# Altium project XsensCustomDevKit.PrjPcb
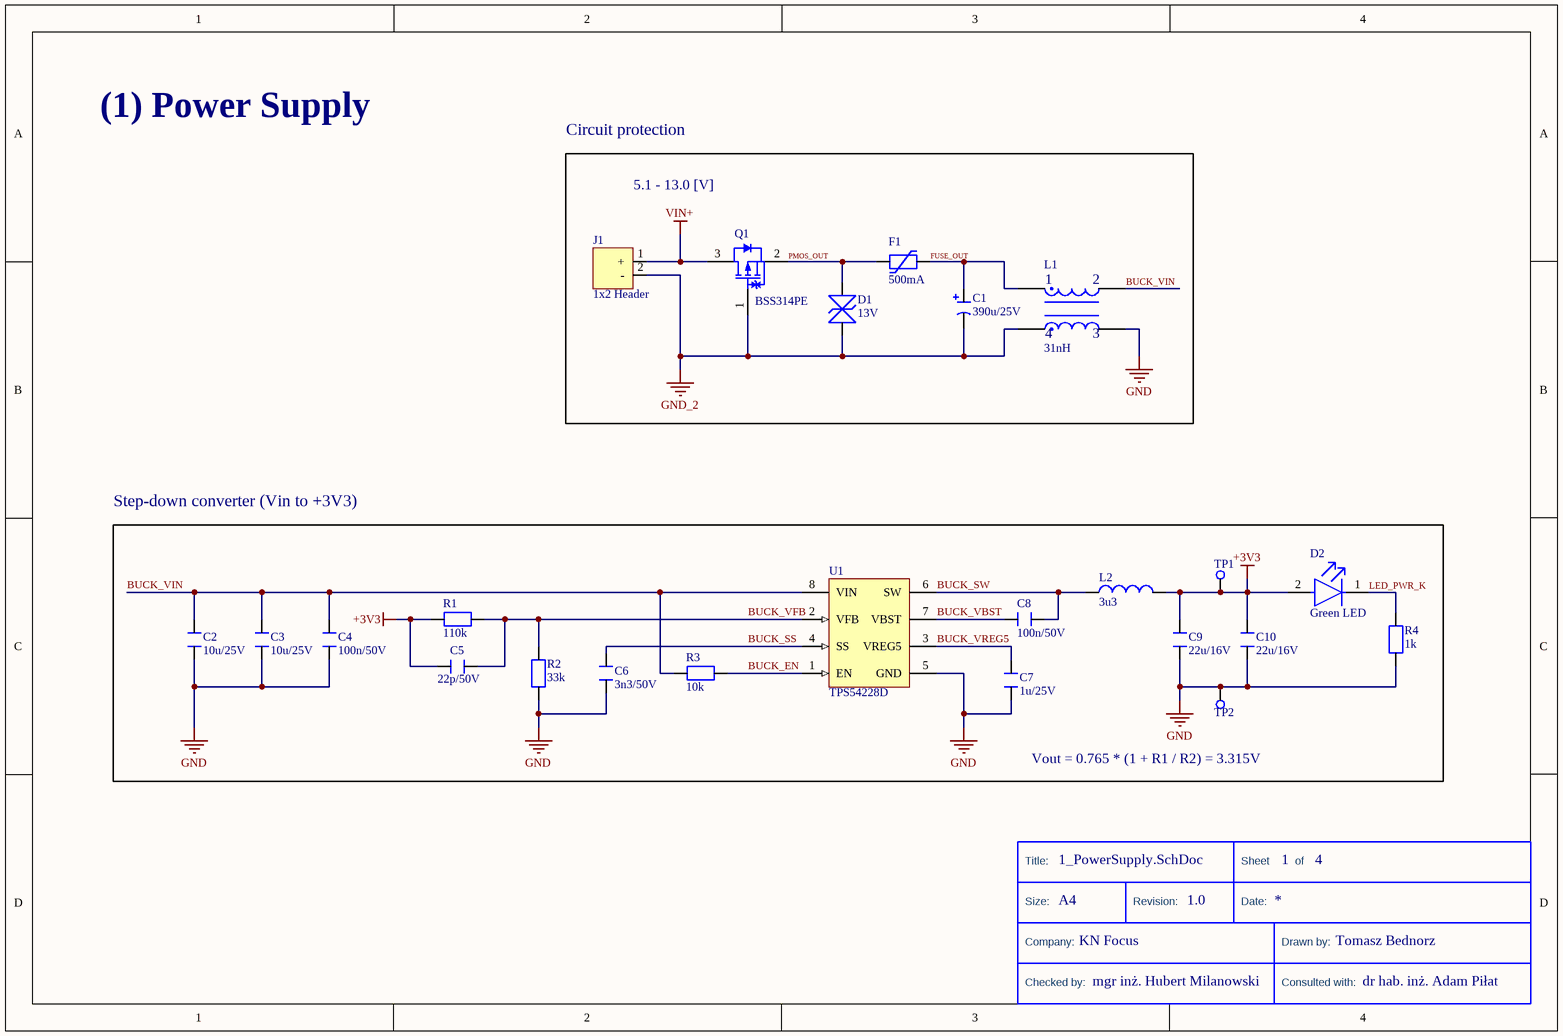
[diagram p0: 1_PowerSupply.SchDoc]
CheckedBy: mgr inż. Hubert Milanowski; CompanyName: KN Focus; ConsultedBy: dr hab. inż. Adam Piłat; DrawnBy: Tomasz Bednorz; Revision: 2.0
4 sheets, 78 parts. Net scope: flat (ports and power ports of the same name join across sheets).
Board file: XSensCustomDevKitPCB.PcbDoc
Sheets:
  1_PowerSupply.SchDoc
  2_MCU.SchDoc
  3_IMU_ETH.SchDoc
  4_SD_Card.SchDoc

## Sheet 1_PowerSupply.SchDoc
size A4; Revision: 1.0; SheetNumber: 1; SheetTotal: 4

### Parts
(Parts that share a designator on the sheet are numbered #1, #2 ... from top to bottom, then left to right.)
*#1  Size: A4  (hidden comment: TitleBlock)  (graphical)
C1  390u/25V  [CAP_ELECTROLYTIC D8]
C2  10u/25V  [CAP_1206]
C3  10u/25V  [CAP_1206]
C4  100n/50V  [CAP_1206]
C5  22p/50V  [CAP_1206]
C6  3n3/50V  [CAP_1206]
C7  1u/25V  [CAP_1206]
C8  100n/50V  [CAP_1206]
C9  22u/16V  [CAP_1206]
C10  22u/16V  [CAP_1206]
D1  13V  [TVS_Littlefuse]
D2  Green LED  [FP-LTST-C150KGKT-MFG]
F1  500mA  [Fuse_1210]
J1  1x2 Header  [1x2 Header (Terminal Block 5.08mm)]
L1  31nH  [CMC-1206USB]
L2  3u3  [IND_DJNR5020-3R3-S]
Q1  BSS314PE  [INF-PG-SOT23_N]
R1  110k  [RES_1206]
R2  33k  [RES_1206]
R3  10k  [RES_1206]
R4  1k  [RES_1206]
TP1  TestPoint Pad 1.0mmx1.0mm  [TestPoint Pad 1.0mmx1.0mm]  (value not drawn)
TP2  TestPoint Pad 1.0mmx1.0mm  [TestPoint Pad 1.0mmx1.0mm]  (value not drawn)
U1  TPS54228D  [D0008A_L]

### Blocks framed on the sheet
Circuit protection: C1 D1 F1 J1 L1 Q1
Step-down converter (Vin to +3V3): C2-C10 D2 L2 R1-R4 TP1 TP2 U1

### Nets
+3V3: C5.2 C9.1 C10.1 D2.2(A) L2.2 R1.2 TP1.1
GND: C2.1 C3.1 C4.1 C6.1 C7.2 C9.2 C10.2 L1.3 R2.2 R4.2 TP2.1 U1.5(GND)
GND_2: C1.1 D1.2 J1.2(-) L1.4 Q1.1(GATE)
VIN+: J1.1(+) Q1.3(DRAIN)
BUCK_EN: R3.1 U1.1(EN)
BUCK_SS: C6.2 U1.4(SS)
BUCK_SW: C8.2 L2.1 U1.6(SW)
BUCK_VBST: C8.1 U1.7(VBST)
BUCK_VFB: C5.1 R1.1 R2.1 U1.2(VFB)
BUCK_VIN: C2.2 C3.2 C4.2 L1.2 R3.2 U1.8(VIN)
BUCK_VREG5: C7.1 U1.3(VREG5)
FUSE_OUT: C1.2 F1.2 L1.1
LED_PWR_K: D2.1(C) R4.1
PMOS_OUT: D1.1 F1.1 Q1.2(SOURCE)

### Notes on the sheet
- (1) Power Supply
- 5.1 - 13.0 [V]
- Vout = 0.765 * (1 + R1 / R2) = 3.315V
- (in symbol TitleBlock) Title:; Sheet; of; Size:; Revision:; Date:; Company:; Drawn by:; Checked by:; Consulted with:

### Library data of the parts
*#1 = TitleBlock: Standard Title Block
C1 = CAP_ELECTROLYTIC D8
C2-C10 = CAP_1206: Generic 1206/3216 capacitor
D1 = TVS_13V: TVS Diode TVS_SMAJ13CA  13V Bidirectional
D2 = CMP-22017-000010-1: LED GREEN CLEAR 1206 SMD; Power Dissipation: 75mW; Number of LEDs: 1; Reverse Voltage: 5V; Lens Style: Diffused; Test Current: 20mA; Forward Current: 30mA; Luminous Intensity: 71mcd; Dominant Wavelength: 571nm; Lens Color: Colorless; Viewing Angle: 130°; Forward Voltage: 2V; Wavelength: 574nm; Length: 3.2mm; Case Code (Imperial): 1206; Illumination Color: Green; Number of Pins: 2; Case Code (Metric): 3216; Package Quantity: 1; Height: 1.1mm; Power Rating: 75mW; Color: Green; Lead Free: Lead Free; Mount: Surface Mount; Radiation Hardening: No; Max Operating Temperature: 85°C; Depth: 1.6mm; Case/Package: 1206; Number of Elements: 1; Lens Transparency: Clear; Min Operating Temperature: -55°C; Packaging: Tape and Reel; Width: 1.6mm
F1 = FUSE_0ZCH0050FF2G: FUSE 500mA/16V
J1 = 1x2 Header (Terminal Block 5.08mm): 1x2 Header, Through Hole(Terminal Block 5.08mm)
L1 = CMC-1206USB: 31nH @ 100MHz 2 Line Common Mode Choke Surface Mount 37 Ohms @ 100MHz 1A DCR 0.1 Ohms
L2 = IND_DJNR5020-3R3-S
Q1 = CMP-1099-00027-1: P-Channel OptiMOS P3 Small-Signal-Transistor, -30 V VDS, -1.5 A ID, -55 to 150 degC, PG-SOT23, Reel, Green; Manufacturer: Infineon; Rth: 250Â K/W; RDS (on) (max): 140Â mOhm; QG: -2.9Â nC; IDpuls (max): -6.1Â A; RDS (on) (max) (@4.5V): 230Â mOhm; Pto t (max): 0.5Â W; Green: TRUE; VDS (max): -30Â V; VGS(th) (max): -2Â V; VGS(th) (min): -1Â V; ID (max): -1.5Â A; ComponentLink2URL: http://www.infineon.com/dgdl/BSS314PE_rev2.3.pdf?folderId=db3a304314dca38901154a72e3951a65&fileId=db3a304330f68606013109b696aa0084; ComponentLink3Description: Package Specification; ComponentLink1URL: http://www.infineon.com/; ComponentLink1Description: Manufacturer URL; Mounting Technology: Surface Mount; PartNumber: BSS314PE; PackageReference: PG-SOT23; PackageVersion: Apr-08; Halogen-free: TRUE; ComponentLink3URL: http://www.infineon.com/dgdl/SOT23-Package_Overview.pdf?folderId=db3a30431936bc4b0119532290053c66&fileId=db3a30431936bc4b0119533468123c85; PackageDescription: 3-Pin Small Outline Transistor Package, 2.9 x 1.3 mm Body, 0.95 mm Pitch; ComponentLink2Description: Datasheet; DatasheetVersion: Rev. 2.3; Packing: Reel
R1-R4 = RES_1206: Generic 1206/3216 resistor
U1 = CMP-0323-00178-3: Buck Step Down Regulator with 4.5 to 18 V Input and 0.76 to 7 V Output, -40 to 85 degC, 8-Pin SOIC (D), Green (RoHS & no Sb/Br); Manufacturer: Texas Instruments; Iout(Max)(A): 2; Vout(Min)(V): 0.76; Switch Current Limit(Typ)(A): 3.3; Rating: Catalog; SubFamily: Step-Down Regulator; Vin(Max)(V): 18; Duty Cycle(Max)(%): 90; Iq(Typ)(mA): 0.8; Regulated Outputs(#): 1; Synchronous Rectification: TRUE; Vin(Min)(V): 4.5; Vout(Max)(V): 7; ComponentLink1Description: Datasheet; Topology: Buck; ComponentLink2Description: Package Specification; PackageVersion: revM, Jun-2011; Mounting Technology: Surface Mount; PackageDescription: 8-Pin Plastic Small Outline Integrated Circuit, 4.9 x 3.9 mm, Pitch 1.27 mm Pitch; ComponentLink3URL: Samples URL:http://www.ti.com/product/tps54228#samples; ComponentLink2URL: http://www.ti.com/litv/pdf/msoi002j; ComponentLink3Description: URL Link1; PartNumber: TPS54228D; Code_JEDEC: MS-012AA; DatasheetVersion: SLVSAU1C; Eco-Plan: Green (RoHS & no Sb/Br); ComponentLink1URL: http://www.ti.com/general/docs/lit/getliterature.tsp?genericPartNumber=TPS54228&fileType=pdf; PackageReference: D0008A

## Sheet 2_MCU.SchDoc
size A3; Revision: 1.0; SheetNumber: 2; SheetTotal: 4
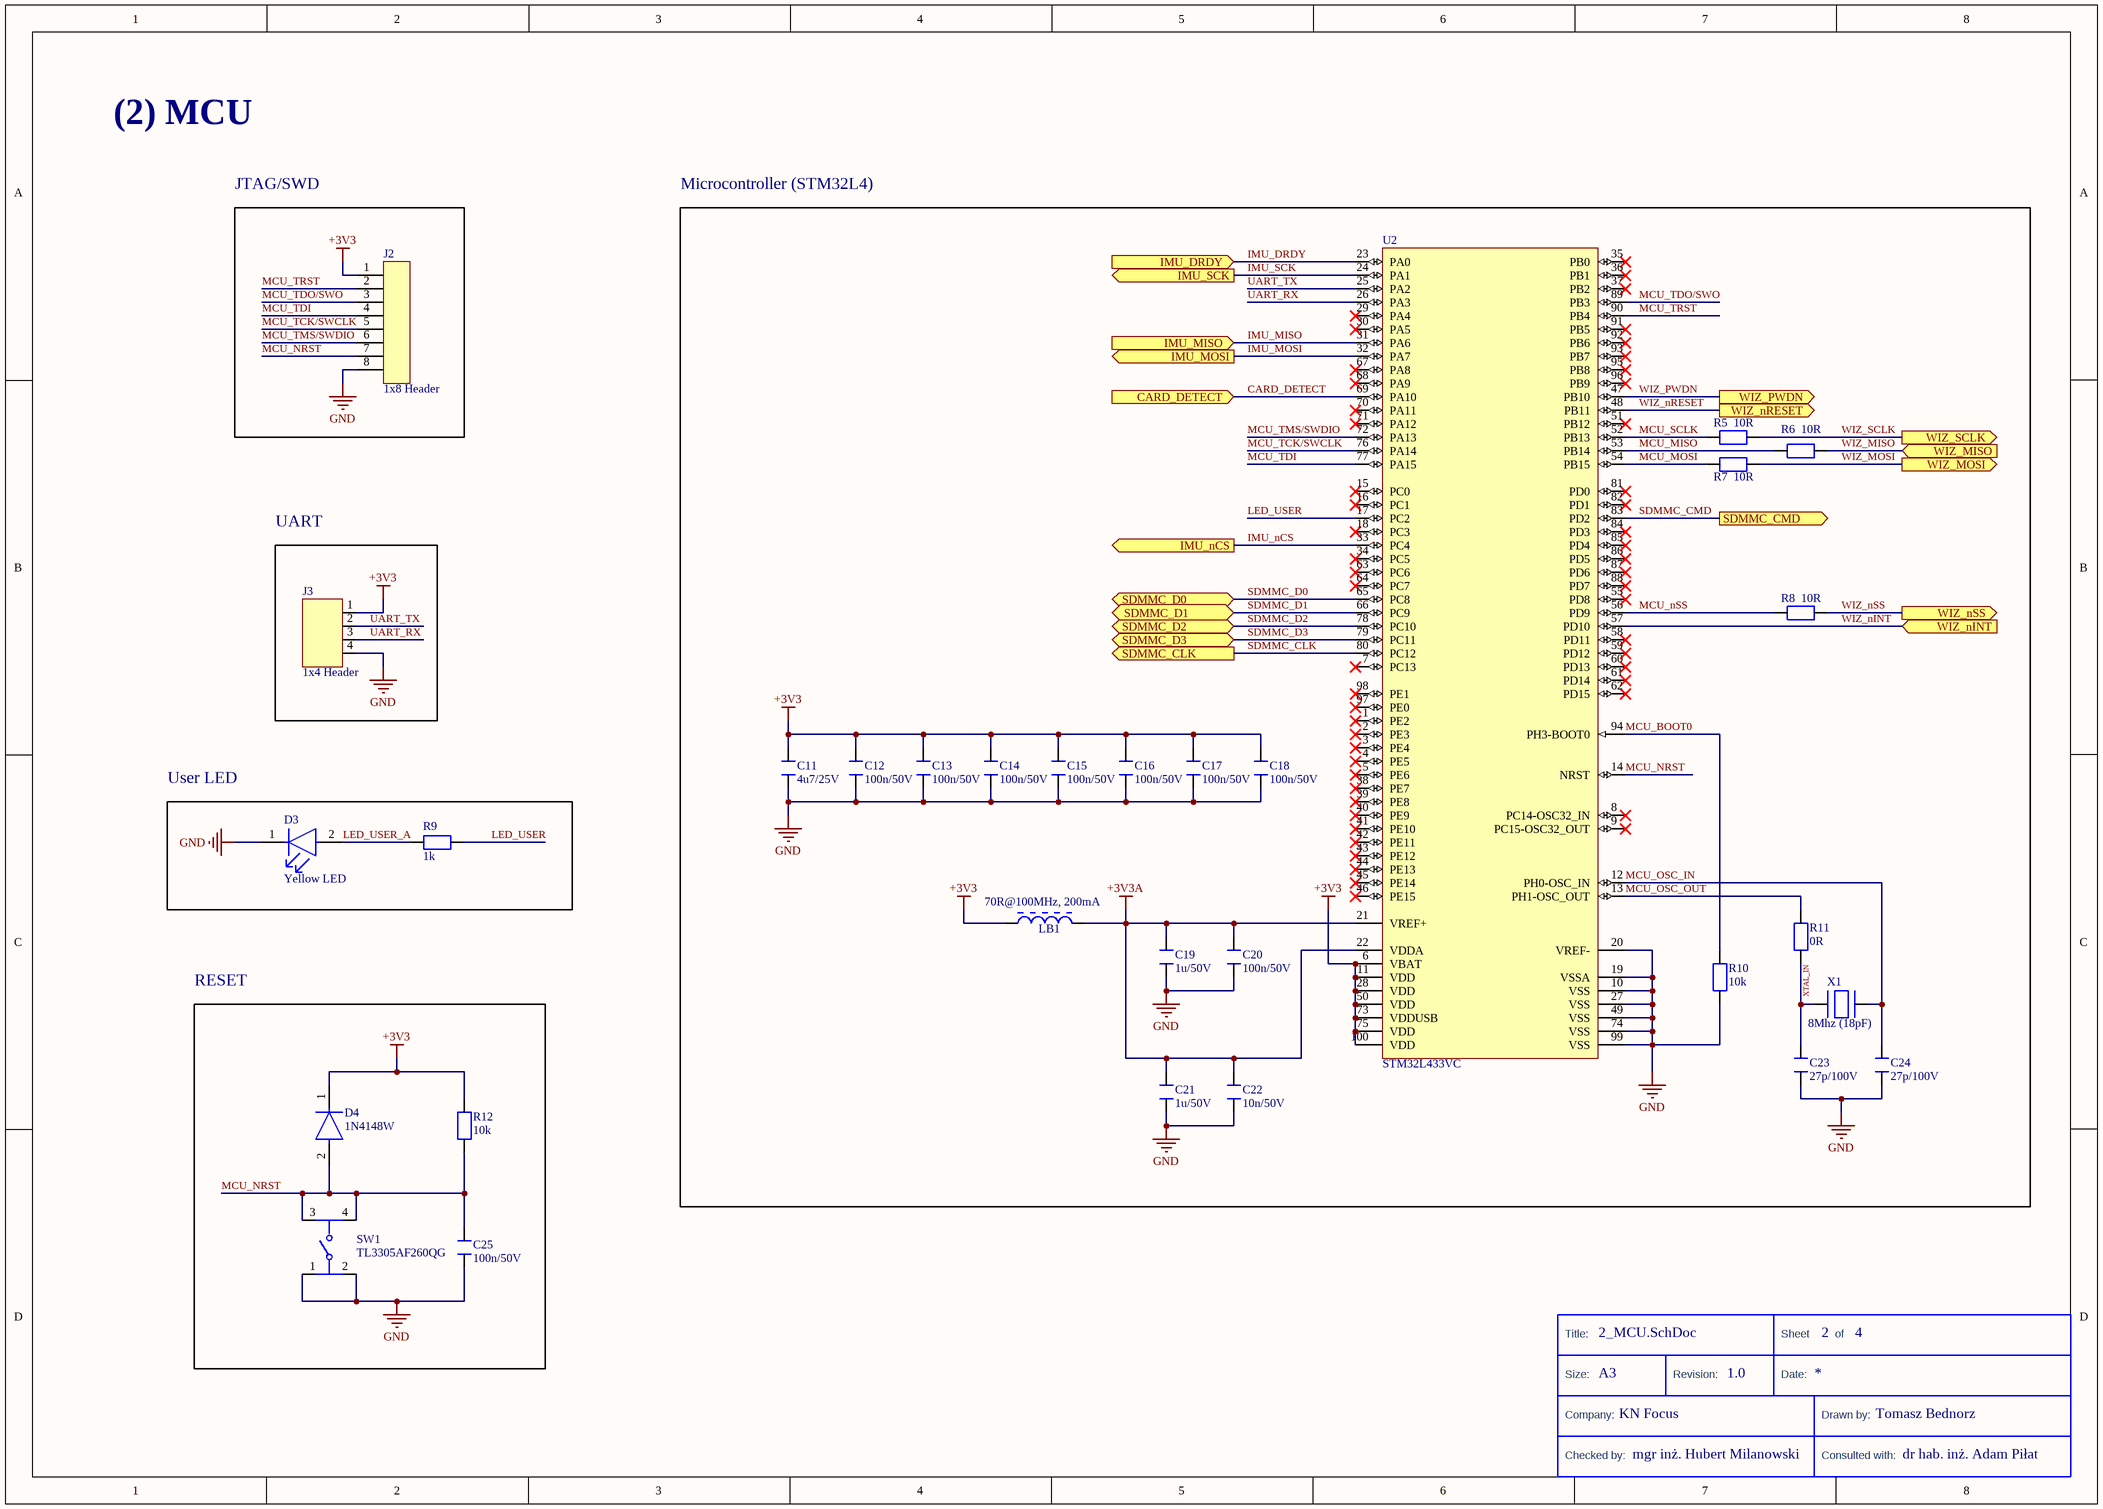
[diagram p1: 2_MCU.SchDoc]

### Parts
(Parts that share a designator on the sheet are numbered #1, #2 ... from top to bottom, then left to right.)
*#2  Size: A3  (hidden comment: TitleBlock)  (graphical)
C11  4u7/25V  [CAP_1206]
C12  100n/50V  [CAP_1206]
C13  100n/50V  [CAP_1206]
C14  100n/50V  [CAP_1206]
C15  100n/50V  [CAP_1206]
C16  100n/50V  [CAP_1206]
C17  100n/50V  [CAP_1206]
C18  100n/50V  [CAP_1206]
C19  1u/50V  [CAP_1206]
C20  100n/50V  [CAP_1206]
C21  1u/50V  [CAP_1206]
C22  10n/50V  [CAP_1206]
C23  27p/100V  [CAP_1206]
C24  27p/100V  [CAP_1206]
C25  100n/50V  [CAP_1206]
D3  Yellow LED  [FP-LTST-C150KSKT-MFG]
D4  1N4148W  [FP-SOD-123-IPC_A]
J2  1x8 Header  [1x8 Header]
J3  1x4 Header  [1x4 Header (Goldpin 2.54mm)]
LB1  70R@100MHz, 200mA  [MURA-BLM31A_L]
R5  10R  [RES_1206]
R6  10R  [RES_1206]
R7  10R  [RES_1206]
R8  10R  [RES_1206]
R9  1k  [RES_1206]
R10  10k  [RES_1206]
R11  0R  [RES_1206]
R12  10k  [RES_1206]
SW1  TL3305AF260QG  [FP-TL3305AF260QG-MFG]
U2  STM32L433VC  [LQFP100]
X1  8Mhz (18pF)  [XTAL-12.5x4.8]

### Blocks framed on the sheet
JTAG/SWD: J2
Microcontroller (STM32L4): C11-C24 LB1 R5-R8 R10 R11 U2 X1
UART: J3
User LED: D3 R9
RESET: C25 D4 R12 SW1

### Ports
CARD_DETECT (in), IMU_DRDY (in), IMU_MISO (in), IMU_MOSI (out), IMU_nCS (out), IMU_SCK (out), SDMMC_CLK (out), SDMMC_CMD (out), SDMMC_D0 (bidir), SDMMC_D1 (bidir), SDMMC_D2 (bidir), SDMMC_D3 (bidir), WIZ_MISO (in), WIZ_MOSI (out), WIZ_nINT (in), WIZ_nRESET (out), WIZ_nSS (out), WIZ_PWDN (out), WIZ_SCLK (out)

### Nets
+3V3: C11.2 C12.2 C13.2 C14.2 C15.2 C16.2 C17.2 C18.2 D4.1(C) J2.1 J3.1 LB1.1 R12.2 U2.6(VBAT) U2.11(VDD) U2.28(VDD) U2.50(VDD) U2.73(VDDUSB) U2.75(VDD) U2.100(VDD)
+3V3A: C19.2 C20.2 C21.2 C22.2 LB1.2 U2.21(VREF+) U2.22(VDDA)
GND: C11.1 C12.1 C13.1 C14.1 C15.1 C16.1 C17.1 C18.1 C19.1 C20.1 C21.1 C22.1 C23.1 C24.1 C25.1 D3.1(C) J2.8 J3.4 R10.1 SW1.1 SW1.2 U2.10(VSS) U2.19(VSSA) U2.20(VREF-) U2.27(VSS) U2.49(VSS) U2.74(VSS) U2.99(VSS)
CARD_DETECT: U2.69(PA10) ; port CARD_DETECT
IMU_DRDY: U2.23(PA0) ; port IMU_DRDY
IMU_MISO: U2.31(PA6) ; port IMU_MISO
IMU_MOSI: U2.32(PA7) ; port IMU_MOSI
IMU_nCS: U2.33(PC4) ; port IMU_nCS
IMU_SCK: U2.24(PA1) ; port IMU_SCK
LED_USER: R9.1 U2.17(PC2)
LED_USER_A: D3.2(A) R9.2
MCU_BOOT0: R10.2 U2.94(PH3-BOOT0)
MCU_MISO: R6.2 U2.53(PB14)
MCU_MOSI: R7.2 U2.54(PB15)
MCU_NRST: C25.2 D4.2(A) J2.7 R12.1 SW1.3 SW1.4 U2.14(NRST)
MCU_nSS: R8.2 U2.56(PD9)
MCU_OSC_IN: C24.2 U2.12(PH0-OSC_IN) X1.2
MCU_OSC_OUT: R11.1 U2.13(PH1-OSC_OUT)
MCU_SCLK: R5.2 U2.52(PB13)
MCU_TCK/SWCLK: J2.5 U2.76(PA14)
MCU_TDI: J2.4 U2.77(PA15)
MCU_TDO/SWO: J2.3 U2.89(PB3)
MCU_TMS/SWDIO: J2.6 U2.72(PA13)
MCU_TRST: J2.2 U2.90(PB4)
SDMMC_CLK: U2.80(PC12) ; port SDMMC_CLK
SDMMC_CMD: U2.83(PD2) ; port SDMMC_CMD
SDMMC_D0: U2.65(PC8) ; port SDMMC_D0
SDMMC_D1: U2.66(PC9) ; port SDMMC_D1
SDMMC_D2: U2.78(PC10) ; port SDMMC_D2
SDMMC_D3: U2.79(PC11) ; port SDMMC_D3
UART_RX: J3.3 U2.26(PA3)
UART_TX: J3.2 U2.25(PA2)
WIZ_MISO: R6.1 ; port WIZ_MISO
WIZ_MOSI: R7.1 ; port WIZ_MOSI
WIZ_nINT: U2.57(PD10) ; port WIZ_nINT
WIZ_nRESET: U2.48(PB11) ; port WIZ_nRESET
WIZ_nSS: R8.1 ; port WIZ_nSS
WIZ_PWDN: U2.47(PB10) ; port WIZ_PWDN
WIZ_SCLK: R5.1 ; port WIZ_SCLK
XTAL_IN: C23.2 R11.2 X1.1

Not connected (* = marked no-connect by the designer): U2 1(PE2)* 2(PE3)* 3(PE4)* 4(PE5)* 5(PE6)* 7(PC13)* 8(PC14-OSC32_IN)* 9(PC15-OSC32_OUT)* 15(PC0)* 16(PC1)* 18(PC3)* 29(PA4)* 30(PA5)* 34(PC5)* 35(PB0)* 36(PB1)* 37(PB2)* 38(PE7)* 39(PE8)* 40(PE9)* 41(PE10)* 42(PE11)* 43(PE12)* 44(PE13)* 45(PE14)* 46(PE15)* 51(PB12)* 55(PD8)* 58(PD11)* 59(PD12)* 60(PD13)* 61(PD14)* 62(PD15)* 63(PC6)* 64(PC7)* 67(PA8)* 68(PA9)* 70(PA11)* 71(PA12)* 81(PD0)* 82(PD1)* 84(PD3)* 85(PD4)* 86(PD5)* 87(PD6)* 88(PD7)* 91(PB5)* 92(PB6)* 93(PB7)* 95(PB8)* 96(PB9)* 97(PE0)* 98(PE1)*

### Notes on the sheet
- (2) MCU
- (in symbol TitleBlock) Title:; Sheet; of; Size:; Revision:; Date:; Company:; Drawn by:; Checked by:; Consulted with:

### Library data of the parts
*#2 = TitleBlock: Standard Title Block
C11-C25 = CAP_1206: Generic 1206/3216 capacitor
D3 = CMP-2000-06618-2: LED YELLOW CLEAR 1206 SMD; Power Rating: 75mW; Wavelength: 588nm; Forward Current: 30mA; Test Current: 20mA; Viewing Angle: 130°; Forward Voltage: 2.4V; Luminous Intensity: 60mcd; Lens Style: Diffused; Number of Elements: 1; Reverse Voltage: 5V; Lens Color: Colorless; Dominant Wavelength: 587nm; Mount: Surface Mount; Min Operating Temperature: -55°C; Depth: 1.6mm; Max Operating Temperature: 85°C; Color: Yellow; Power Dissipation: 75mW; Width: 1.6mm; Packaging: Tape and Reel; Length: 3.2mm; Illumination Color: Yellow; Number of Pins: 2; Case Code (Metric): 3216; Lead Free: Lead Free; Package Quantity: 1; Radiation Hardening: No; Height: 1.1mm; Case Code (Imperial): 1206; Number of LEDs: 1; Case/Package: 1206; Lens Transparency: Clear
D4 = CMP-2000-04993-2: DIODE GEN PURP 100V 150MA SOD123; Max Reverse Leakage Current: 5uA; Max Surge Current: 2A; Reverse Recovery Time: 4ns; Polarity: Standard; Capacitance: 4pF; Max Forward Surge Current (Ifsm): 1A; Element Configuration: Single; Power Dissipation: 400mW; Forward Voltage: 1V; Radiation Hardening: No; Lead Free: Lead Free; Max Reverse Voltage (DC): 100V; Current Rating: 150mA; Forward Current: 150mA; Packaging: Tape and Reel; Number of Pins: 2; Package Quantity: 3000; Max Operating Temperature: 150°C; Min Operating Temperature: -65°C; Average Rectified Current: 150mA; Recovery Time: 4ns; Output Current: 150mA; Peak Non-Repetitive Surge Current: 2A; Width: 1.8mm; Voltage Rating (DC): 100V; Height: 1.2mm; Max Repetitive Reverse Voltage (Vrrm): 100V; Mount: Surface Mount; Length: 2.85mm
J2 = 1x8 Header: 1x8 Header,Through Hole (Goldpin 2.54m)
J3 = 1x4 Header (Goldpin 2.54mm): 1x4 Header,Through Hole (Goldpin 2.54mm)
LB1 = CMP-2000-05955-1: Chip Bead, 100 MHz, 200 mA, -55 to 125 degC, 2-Pin SMD (1206), RoHS, Tape and Reel; Manufacturer: Murata; Brand: MurataElectronics; Case Height: 1.1mm; Maximum DC Resistance: 150mOhms; Case Length: 3.2mm; Tolerance: 25%; Case Width: 1.6mm; Impedance: 70Ohms; Test Frequency: 100MHz; Product Category: EMIFilterBeads,Chips&Arrays; Series: BLM31A; Manufacturer URL: http://www.murata.com/; Mounting Technology: SurfaceMount; Package / Case: 1206(3216metric); Product: FerriteChipBeads; Package Reference: 1206; Packaging: Reel; Dimensions: 1.6mmWx3.2mmLx1.1mmH; Maximum DC Current: 200mA; Operating Temperature Range: -55Cto+125C; RoHS: Details; Package Description: 2-Pin Surface Mount Device, Body 3.2 x 1.6 mm; Termination Style: SMD/SMT; Datasheet URL: http://www.mouser.com/ds/2/281/L0110S0100BLM31A_SP-767397.pdf; Datasheet Version: 11/2007; Factory Pack Quantity: 2500
R5-R12 = RES_1206: Generic 1206/3216 resistor
SW1 = CMP-17879-000010-1: SWITCH TACTILE SPST-NO 50MA 12V; Mechanical Life: 200000Cycles; Switch Function: Off-Mom; Actuator Type: Standard; Operating Force: 260gf; Illumination Type: Non-Illuminated; Switch Travel: 0.2mm; Throw Configuration: SPST; Min Operating Temperature: -20°C; Max Operating Temperature: 70°C; Lead Free: Lead Free; Mount: Surface Mount; Packaging: Tape and Reel; Termination: Gull Wing
U2 = STM32L433VC: STM32L433RC, 80MHz, Coretx-M4
X1 = XTAL-8MHz

## Sheet 3_IMU_ETH.SchDoc
size A4; Revision: 1.0; SheetNumber: 3; SheetTotal: 4
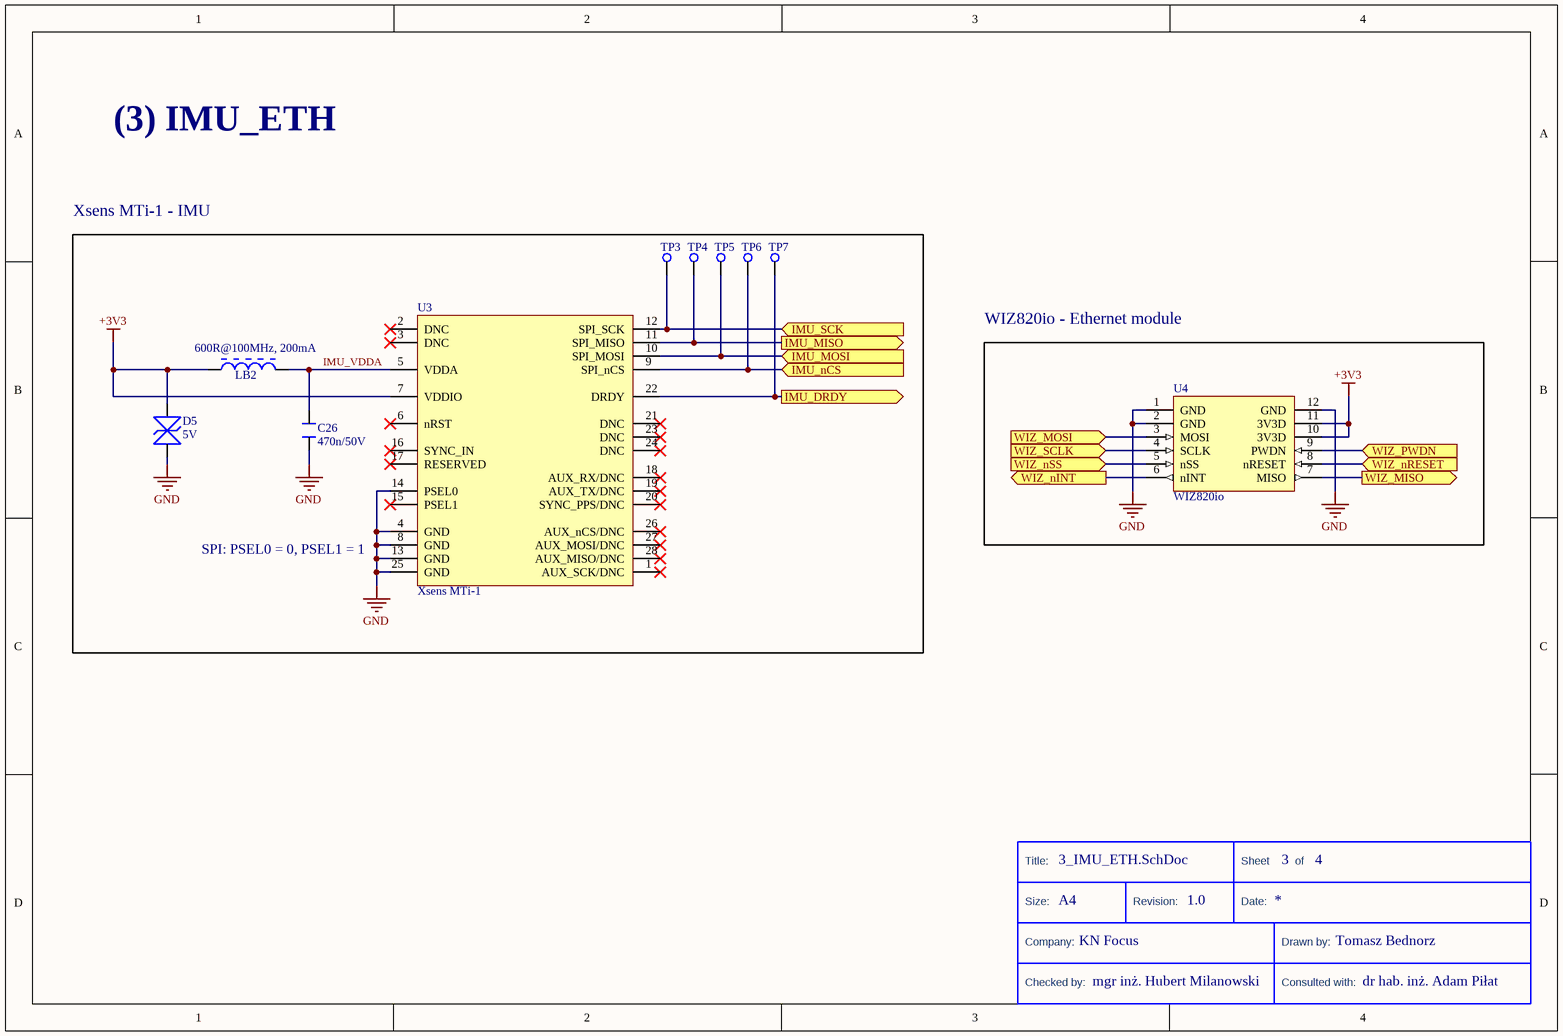
[diagram p2: 3_IMU_ETH.SchDoc]

### Parts
(Parts that share a designator on the sheet are numbered #1, #2 ... from top to bottom, then left to right.)
*#3  Size: A4  (hidden comment: TitleBlock)  (graphical)
C26  470n/50V  [CAP_1206]
D5  5V  [TVS_Littlefuse]
LB2  600R@100MHz, 200mA  [MURA-BLM31A_L]
TP3  TestPoint Pad 1.0mmx1.0mm  [TestPoint Pad 1.0mmx1.0mm]  (value not drawn)
TP4  TestPoint Pad 1.0mmx1.0mm  [TestPoint Pad 1.0mmx1.0mm]  (value not drawn)
TP5  TestPoint Pad 1.0mmx1.0mm  [TestPoint Pad 1.0mmx1.0mm]  (value not drawn)
TP6  TestPoint Pad 1.0mmx1.0mm  [TestPoint Pad 1.0mmx1.0mm]  (value not drawn)
TP7  TestPoint Pad 1.0mmx1.0mm  [TestPoint Pad 1.0mmx1.0mm]  (value not drawn)
U3  Xsens MTi-1  [PLCC-28SMD 1.27MM NINIGI]
U4  WIZ820io  [2x6 Header - 20.32 gap]

### Blocks framed on the sheet
Xsens MTi-1 - IMU: C26 D5 LB2 TP3-TP7 U3
WIZ820io - Ethernet module: U4

### Ports
IMU_DRDY (out), IMU_MISO (out), IMU_MOSI (in), IMU_nCS (in), IMU_SCK (in), WIZ_MISO (out), WIZ_MOSI (in), WIZ_nINT (out), WIZ_nRESET (in), WIZ_nSS (in), WIZ_PWDN (in), WIZ_SCLK (in)

### Nets
+3V3: D5.1 LB2.1 U3.7(VDDIO) U4.10(3V3D) U4.11(3V3D)
GND: C26.1 D5.2 U3.4(GND) U3.8(GND) U3.13(GND) U3.14(PSEL0) U3.25(GND) U4.1(GND) U4.2(GND) U4.12(GND)
IMU_DRDY: TP7.1 U3.22(DRDY) ; port IMU_DRDY
IMU_MISO: TP4.1 U3.11(SPI_MISO) ; port IMU_MISO
IMU_MOSI: TP5.1 U3.10(SPI_MOSI) ; port IMU_MOSI
IMU_nCS: TP6.1 U3.9(SPI_nCS) ; port IMU_nCS
IMU_SCK: TP3.1 U3.12(SPI_SCK) ; port IMU_SCK
IMU_VDDA: C26.2 LB2.2 U3.5(VDDA)
WIZ_MISO: U4.7(MISO) ; port WIZ_MISO
WIZ_MOSI: U4.3(MOSI) ; port WIZ_MOSI
WIZ_nINT: U4.6(nINT) ; port WIZ_nINT
WIZ_nRESET: U4.8(nRESET) ; port WIZ_nRESET
WIZ_nSS: U4.5(nSS) ; port WIZ_nSS
WIZ_PWDN: U4.9(PWDN) ; port WIZ_PWDN
WIZ_SCLK: U4.4(SCLK) ; port WIZ_SCLK

Not connected (* = marked no-connect by the designer): U3 1(AUX_SCK/DNC)* 2(DNC)* 3(DNC)* 6(nRST)* 15(PSEL1)* 16(SYNC_IN)* 17(RESERVED)* 18(AUX_RX/DNC)* 19(AUX_TX/DNC)* 20(SYNC_PPS/DNC)* 21(DNC)* 23(DNC)* 24(DNC)* 26(AUX_nCS/DNC)* 27(AUX_MOSI/DNC)* 28(AUX_MISO/DNC)*

### Notes on the sheet
- (3) IMU_ETH
- (near U3) SPI: PSEL0 = 0, PSEL1 = 1
- (in symbol TitleBlock) Title:; Sheet; of; Size:; Revision:; Date:; Company:; Drawn by:; Checked by:; Consulted with:

### Library data of the parts
*#3 = TitleBlock: Standard Title Block
C26 = CAP_1206: Generic 1206/3216 capacitor
D5 = TVS_5V: TVS Diode TVS_SMAJ5.0CA  5V Bidirectional
LB2 = CMP-2000-05956-1: Chip EMIFIL(R) Inductor Type Chip Ferrite Bead, 600 Ohm, +/- 25%, -55 to 125 degC, 2-Pin SMD (1206), RoHS, Tape and Reel; Manufacturer: Murata; Test Frequency: 100MHz; Unit Weight: 0.000353oz; Brand: MurataElectronics; Impedance: 600Ohms; Maximum DC Resistance: 900mOhms; Package Reference: 1206; Series: BLM; Packaging: Reel; Manufacturer URL: http://www.murata.com/; Mounting Technology: SurfaceMount; Type: ChipFerriteBeadSingleType; RoHS: True; Package / Case: 1206(3216metric); Height: 1.1mm; Product Category: FerriteBeads; Operating Temperature Range: -55Cto+125C; Maximum DC Current: 200mA; Termination Style: SMD/SMT; Tolerance: 25%; Length: 3.2mm; Datasheet URL: https://datasheet.ciiva.com/1014/blm31a-sp-1014542.pdf; Package Description: 2-Pin Surface Mount Device, Body 3.2 x 1.6 mm; Factory Pack Quantity: 3000; Width: 1.6mm; Product: FerriteChipBeads; Datasheet Version: 11/2007
U3 = Xsens MTi-1: PLCC-28SMD socket for Xsens MTi-1 (SPI)
U4 = WIZ820io: 2x6 Famale Header for WIZ820io ETH controller (W5200)

## Sheet 4_SD_Card.SchDoc
size A4; Revision: 1.0; SheetNumber: 4; SheetTotal: 4
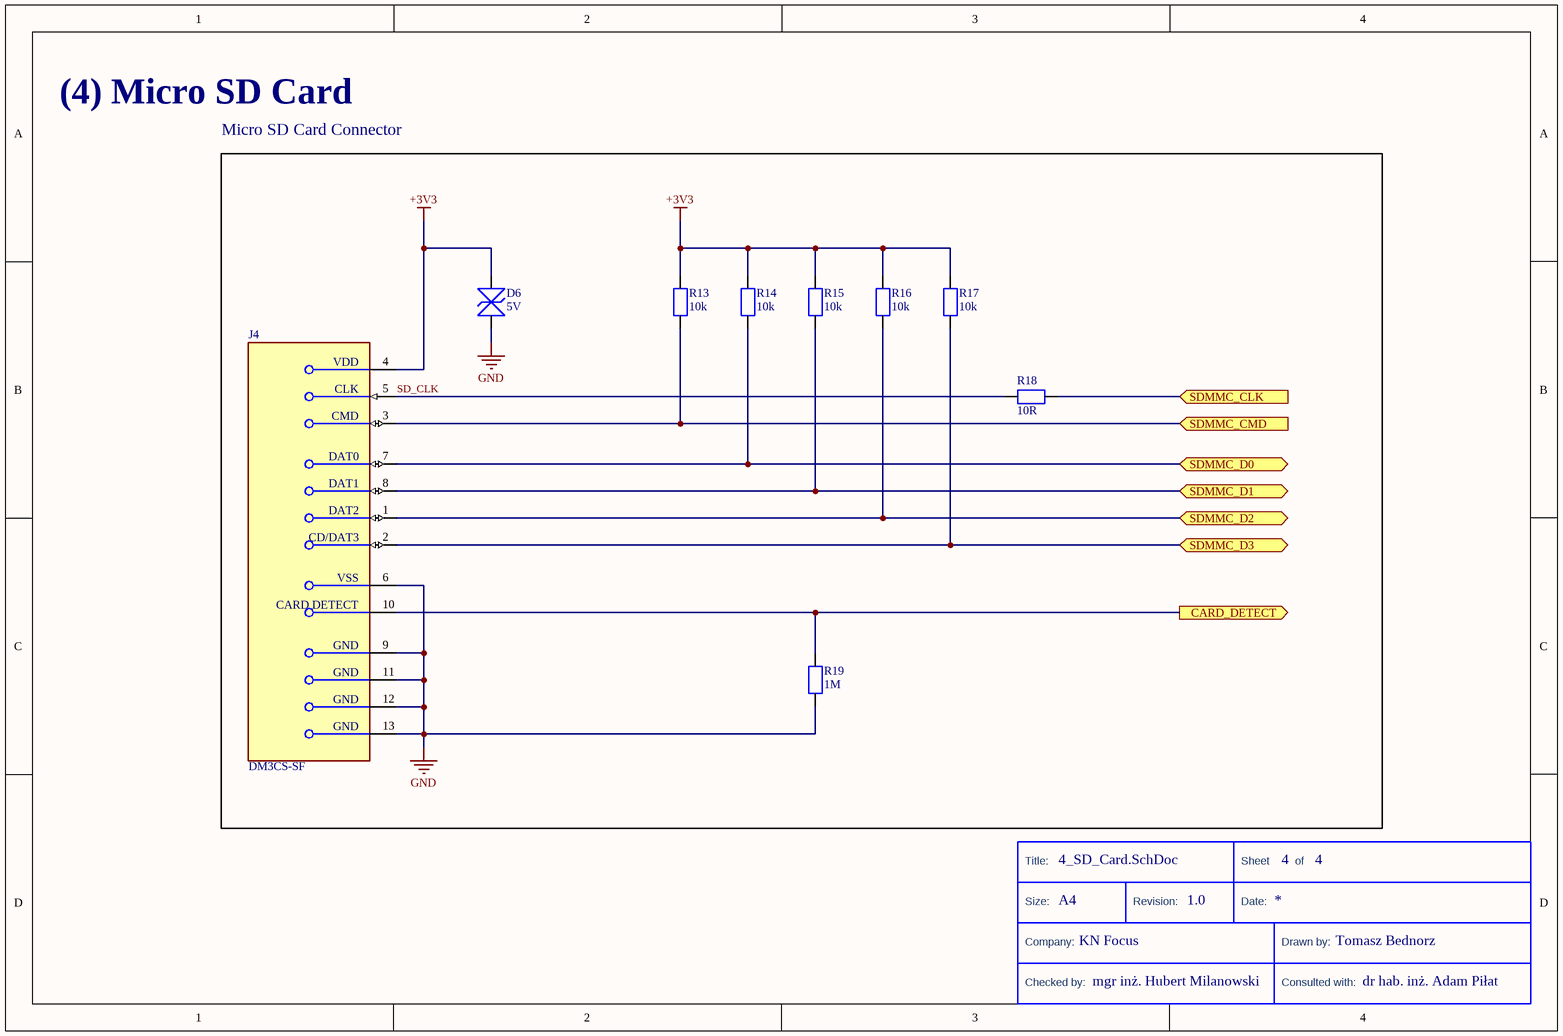
[diagram p3: 4_SD_Card.SchDoc]

### Parts
(Parts that share a designator on the sheet are numbered #1, #2 ... from top to bottom, then left to right.)
*#4  Size: A4  (hidden comment: TitleBlock)  (graphical)
D6  5V  [TVS_Littlefuse]
J4  DM3CS-SF  [FP-DM3CS-SF-MFG]
R13  10k  [RES_1206]
R14  10k  [RES_1206]
R15  10k  [RES_1206]
R16  10k  [RES_1206]
R17  10k  [RES_1206]
R18  10R  [RES_1206]
R19  1M  [RES_1206]

### Blocks framed on the sheet
Micro SD Card Connector: D6 J4 R13-R19

### Ports
CARD_DETECT (out), SDMMC_CLK (in), SDMMC_CMD (in), SDMMC_D0 (bidir), SDMMC_D1 (bidir), SDMMC_D2 (bidir), SDMMC_D3 (bidir)

### Nets
+3V3: D6.1 J4.4(VDD) R13.2 R14.2 R15.2 R16.2 R17.2
GND: D6.2 J4.6(VSS) J4.9(GND) J4.11(GND) J4.12(GND) J4.13(GND) R19.2
CARD_DETECT: J4.10(CARD_DETECT) R19.1 ; port CARD_DETECT
SD_CLK: J4.5(CLK) R18.2
SDMMC_CLK: R18.1 ; port SDMMC_CLK
SDMMC_CMD: J4.3(CMD) R13.1 ; port SDMMC_CMD
SDMMC_D0: J4.7(DAT0) R14.1 ; port SDMMC_D0
SDMMC_D1: J4.8(DAT1) R15.1 ; port SDMMC_D1
SDMMC_D2: J4.1(DAT2) R16.1 ; port SDMMC_D2
SDMMC_D3: J4.2(CD/DAT3) R17.1 ; port SDMMC_D3

### Notes on the sheet
- (4) Micro SD Card
- (in symbol TitleBlock) Title:; Sheet; of; Size:; Revision:; Date:; Company:; Drawn by:; Checked by:; Consulted with:

### Library data of the parts
*#4 = TitleBlock: Standard Title Block
D6 = TVS_5V: as D5 on sheet 3_IMU_ETH
J4 = CMP-11597-000003-1: CONN MICRO SD CARD HINGED TYPE; Pitch: 1.1mm; Connector Type: Connector; Current Rating: 500mA; Voltage Rating (AC): 125V; Gender: Female; Insulation Resistance: 1GR; Number of Positions: 8; Contact Resistance: 100mR; Packaging: Tape and Reel; Flammability Rating: UL94 V-0; Lead Free: Lead Free; Min Operating Temperature: -25°C; Orientation: Right Angle; Width: 13.8mm; Number of Rows: 1; Housing Material: Polymer; Package Quantity: 1; Mount: Surface Mount; Max Current Rating: 500mA; Radiation Hardening: No; Max Operating Temperature: 85°C; Contact Plating: Gold; Depth: 1.83mm; Contact Material: Gold; Length: 14.1mm; Number of Contacts: 8; Termination: Solder
R13-R19 = RES_1206: Generic 1206/3216 resistor

## Nets that join several sheets
+3V3: 1_PowerSupply (7 pins), 2_MCU (20 pins), 3_IMU_ETH (5 pins), 4_SD_Card (7 pins)
GND: 1_PowerSupply (12 pins), 2_MCU (28 pins), 3_IMU_ETH (10 pins), 4_SD_Card (7 pins)
CARD_DETECT: 2_MCU (U2.69), 4_SD_Card (J4.10 R19.1)
IMU_DRDY: 2_MCU (U2.23), 3_IMU_ETH (TP7.1 U3.22)
IMU_MISO: 2_MCU (U2.31), 3_IMU_ETH (TP4.1 U3.11)
IMU_MOSI: 2_MCU (U2.32), 3_IMU_ETH (TP5.1 U3.10)
IMU_nCS: 2_MCU (U2.33), 3_IMU_ETH (TP6.1 U3.9)
IMU_SCK: 2_MCU (U2.24), 3_IMU_ETH (TP3.1 U3.12)
SDMMC_CLK: 2_MCU (U2.80), 4_SD_Card (R18.1)
SDMMC_CMD: 2_MCU (U2.83), 4_SD_Card (J4.3 R13.1)
SDMMC_D0: 2_MCU (U2.65), 4_SD_Card (J4.7 R14.1)
SDMMC_D1: 2_MCU (U2.66), 4_SD_Card (J4.8 R15.1)
SDMMC_D2: 2_MCU (U2.78), 4_SD_Card (J4.1 R16.1)
SDMMC_D3: 2_MCU (U2.79), 4_SD_Card (J4.2 R17.1)
WIZ_MISO: 2_MCU (R6.1), 3_IMU_ETH (U4.7)
WIZ_MOSI: 2_MCU (R7.1), 3_IMU_ETH (U4.3)
WIZ_nINT: 2_MCU (U2.57), 3_IMU_ETH (U4.6)
WIZ_nRESET: 2_MCU (U2.48), 3_IMU_ETH (U4.8)
WIZ_nSS: 2_MCU (R8.1), 3_IMU_ETH (U4.5)
WIZ_PWDN: 2_MCU (U2.47), 3_IMU_ETH (U4.9)
WIZ_SCLK: 2_MCU (R5.1), 3_IMU_ETH (U4.4)